# EAGLE design onionboard (EAGLE 6.5.0)
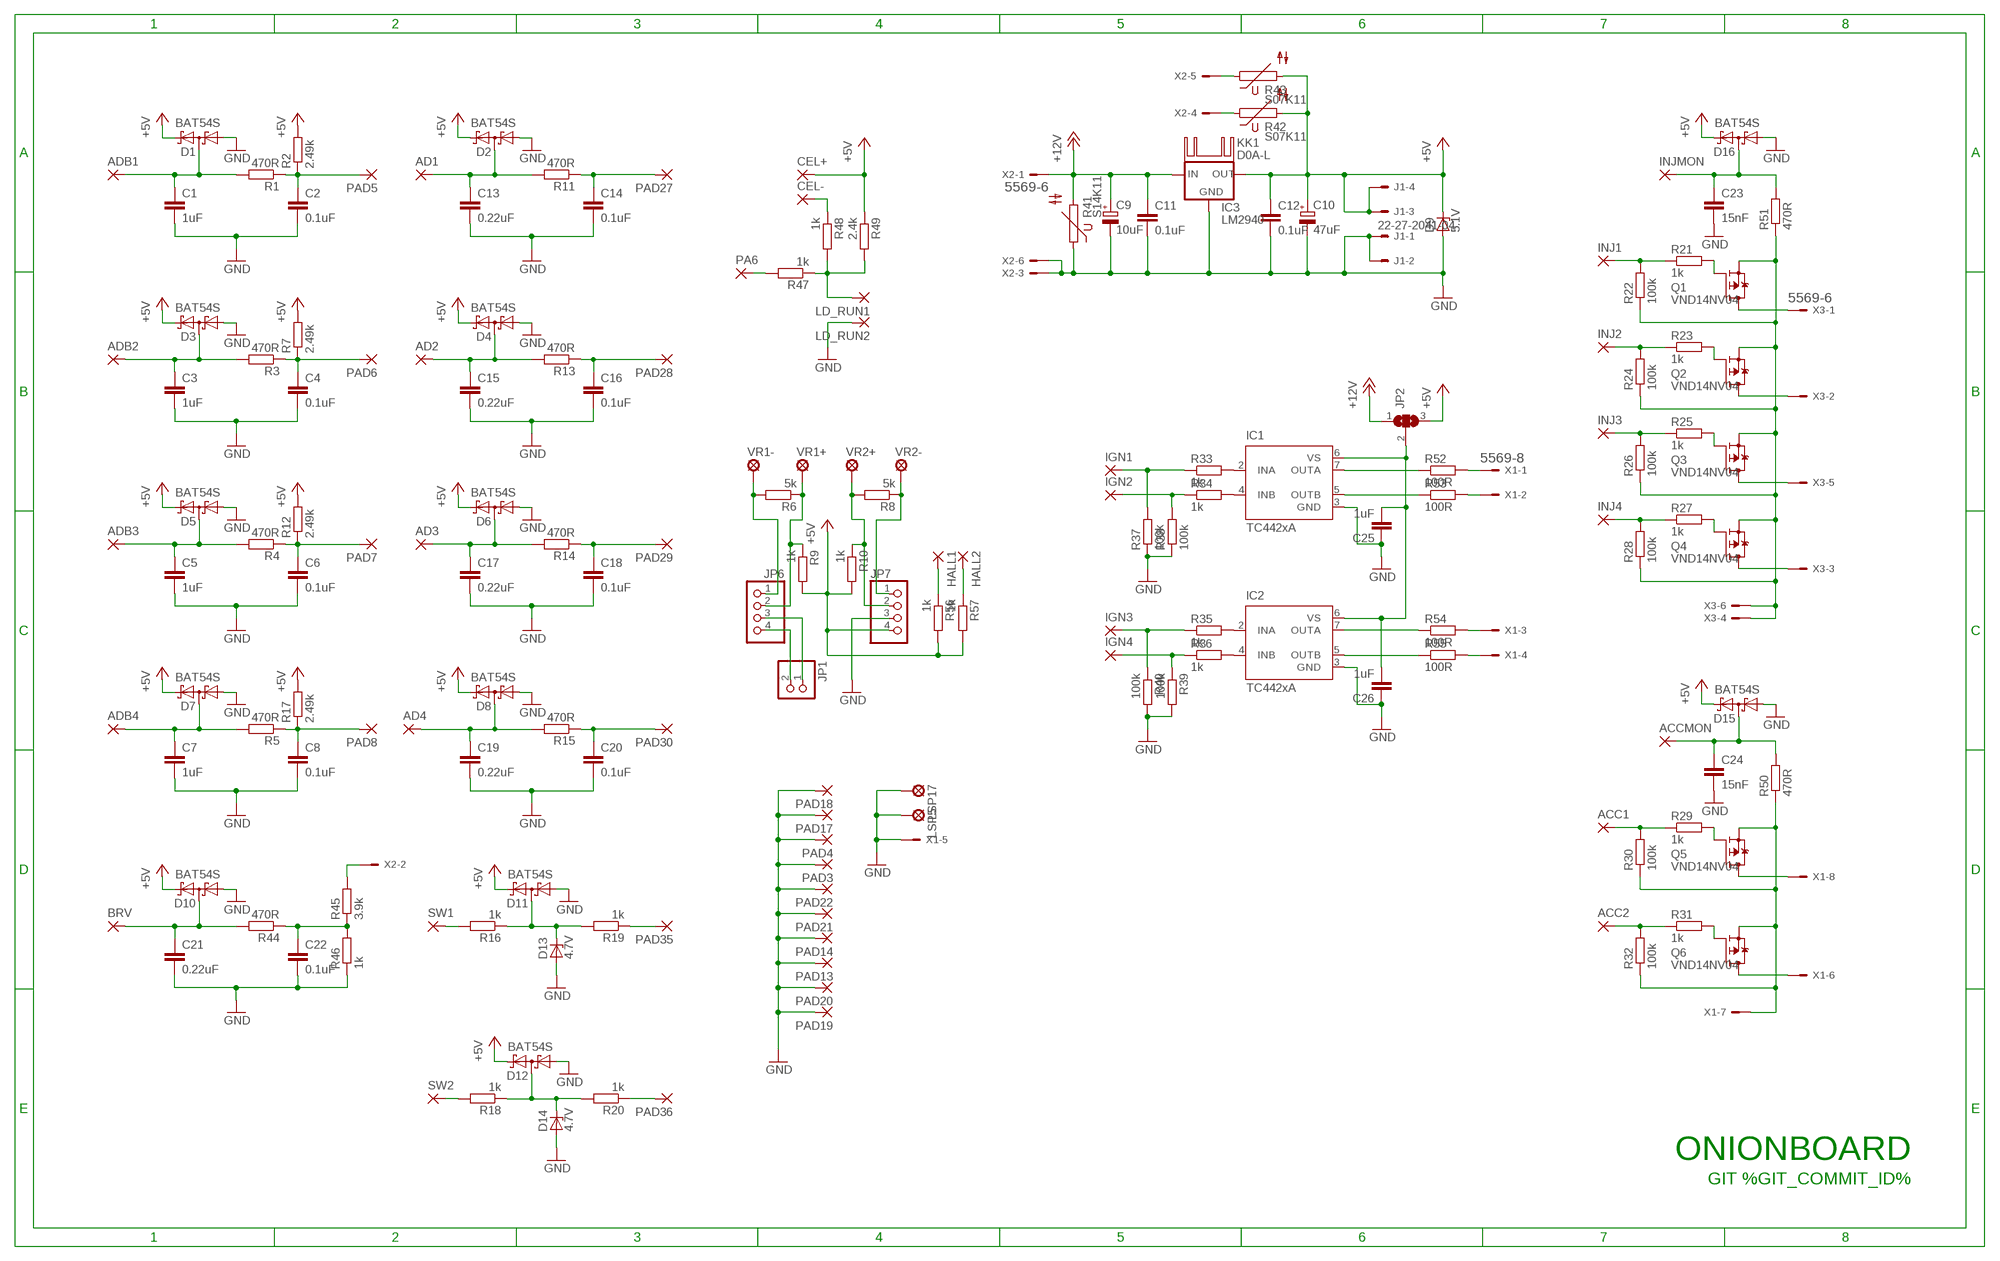
[diagram p0: schematic, sheet 1]

## Parts
ACC1  SMD2  [SMD1,27-2,54]
ACC2  SMD2  [SMD1,27-2,54]
ACCMON  SMD2  [SMD1,27-2,54]
AD1  SMD2  [SMD1,27-2,54]
AD2  SMD2  [SMD1,27-2,54]
AD3  SMD2  [SMD1,27-2,54]
AD4  SMD2  [SMD1,27-2,54]
ADB1  SMD2  [SMD1,27-2,54]
ADB2  SMD2  [SMD1,27-2,54]
ADB3  SMD2  [SMD1,27-2,54]
ADB4  SMD2  [SMD1,27-2,54]
BRV  SMD2  [SMD1,27-2,54]
C1  1uF  C-EUC0805  [C0805]
C2  0.1uF  C-EUC0805  [C0805]
C3  1uF  C-EUC0805  [C0805]
C4  0.1uF  C-EUC0805  [C0805]
C5  1uF  C-EUC0805  [C0805]
C6  0.1uF  C-EUC0805  [C0805]
C7  1uF  C-EUC0805  [C0805]
C8  0.1uF  C-EUC0805  [C0805]
C9  10uF  CPOL-EUSMCE  [SMC_E]
C10  47uF  CPOL-EUSMCE  [SMC_E]
C11  0.1uF  C-EUC1206  [C1206]
C12  0.1uF  C-EUC1206  [C1206]
C13  0.22uF  C-EUC0805  [C0805]
C14  0.1uF  C-EUC0805  [C0805]
C15  0.22uF  C-EUC0805  [C0805]
C16  0.1uF  C-EUC0805  [C0805]
C17  0.22uF  C-EUC0805  [C0805]
C18  0.1uF  C-EUC0805  [C0805]
C19  0.22uF  C-EUC0805  [C0805]
C20  0.1uF  C-EUC0805  [C0805]
C21  0.22uF  C-EUC0805  [C0805]
C22  0.1uF  C-EUC0805  [C0805]
C23  15nF  C-EUC0805  [C0805]
C24  15nF  C-EUC0805  [C0805]
C25  1uF  C-EUC1206  [C1206]
C26  1uF  C-EUC1206  [C1206]
CEL+  SMD2  [SMD1,27-2,54]
CEL-  SMD2  [SMD1,27-2,54]
D1  BAT54S  [SOT23]
D2  BAT54S  [SOT23]
D3  BAT54S  [SOT23]
D4  BAT54S  [SOT23]
D5  BAT54S  [SOT23]
D6  BAT54S  [SOT23]
D7  BAT54S  [SOT23]
D8  BAT54S  [SOT23]
D9  5.1V  ZENER-DIODEP1-12  [P1Z12]
D10  BAT54S  [SOT23]
D11  BAT54S  [SOT23]
D12  BAT54S  [SOT23]
D13  4.7V  ZENER-DIODESOT23  [SOT23]
D14  4.7V  ZENER-DIODESOT23  [SOT23]
D15  BAT54S  [SOT23]
D16  BAT54S  [SOT23]
HALL1  1,6/0,8  [1,6/0,8]
HALL2  1,6/0,8  [1,6/0,8]
IC1  TC442xA  IR4427S  [SO08]
IC2  TC442xA  IR4427S  [SO08]
IC3  LM2940  78XXL  [78XXL]
IGN1  SMD2  [SMD1,27-2,54]
IGN2  SMD2  [SMD1,27-2,54]
IGN3  SMD2  [SMD1,27-2,54]
IGN4  SMD2  [SMD1,27-2,54]
INJ1  SMD2  [SMD1,27-2,54]
INJ2  SMD2  [SMD1,27-2,54]
INJ3  SMD2  [SMD1,27-2,54]
INJ4  SMD2  [SMD1,27-2,54]
INJMON  SMD2  [SMD1,27-2,54]
J1  22-27-2041-04  [6410-04]
JP1  PINHD-1X2  [1X02]
JP2  SJ2W  [SJ_2]
JP6  PINHD-1X4  [1X04]
JP7  PINHD-1X4  [1X04]
KK1  D0A-L  [D02A-L]
LD_RUN1  SMD2  [SMD1,27-2,54]
LD_RUN2  SMD2  [SMD1,27-2,54]
LSP5  LSP10  [LSP10]
LSP17  LSP10  [LSP10]
PA6  SMD2  [SMD1,27-2,54]
PAD3  SMD2  [SMD1,27-2,54]
PAD4  SMD2  [SMD1,27-2,54]
PAD5  SMD2  [SMD1,27-2,54]
PAD6  SMD2  [SMD1,27-2,54]
PAD7  SMD2  [SMD1,27-2,54]
PAD8  SMD2  [SMD1,27-2,54]
PAD13  SMD2  [SMD1,27-2,54]
PAD14  SMD2  [SMD1,27-2,54]
PAD17  SMD2  [SMD1,27-2,54]
PAD18  SMD2  [SMD1,27-2,54]
PAD19  SMD2  [SMD1,27-2,54]
PAD20  SMD2  [SMD1,27-2,54]
PAD21  SMD2  [SMD1,27-2,54]
PAD22  SMD2  [SMD1,27-2,54]
PAD27  SMD2  [SMD1,27-2,54]
PAD28  SMD2  [SMD1,27-2,54]
PAD29  SMD2  [SMD1,27-2,54]
PAD30  SMD2  [SMD1,27-2,54]
PAD35  SMD2  [SMD1,27-2,54]
PAD36  SMD2  [SMD1,27-2,54]
Q1  VND14NV04  FDD4141TO252  [TO252]
Q2  VND14NV04  FDD4141TO252  [TO252]
Q3  VND14NV04  FDD4141TO252  [TO252]
Q4  VND14NV04  FDD4141TO252  [TO252]
Q5  VND14NV04  FDD4141TO252  [TO252]
Q6  VND14NV04  FDD4141TO252  [TO252]
R1  470R  R-EU_R1206  [R1206]
R2  2.49k  R-EU_M0805  [M0805]
R3  470R  R-EU_R1206  [R1206]
R4  470R  R-EU_R1206  [R1206]
R5  470R  R-EU_R1206  [R1206]
R6  5k  R-EU_0411/15  [0411/15]
R7  2.49k  R-EU_M0805  [M0805]
R8  5k  R-EU_0411/15  [0411/15]
R9  1k  R-EU_R0805  [R0805]
R10  1k  R-EU_R0805  [R0805]
R11  470R  R-EU_R1206  [R1206]
R12  2.49k  R-EU_M0805  [M0805]
R13  470R  R-EU_R1206  [R1206]
R14  470R  R-EU_R1206  [R1206]
R15  470R  R-EU_R1206  [R1206]
R16  1k  R-EU_R1206  [R1206]
R17  2.49k  R-EU_M0805  [M0805]
R18  1k  R-EU_R1206  [R1206]
R19  1k  R-EU_R1206  [R1206]
R20  1k  R-EU_R1206  [R1206]
R21  1k  R-EU_M0805  [M0805]
R22  100k  R-EU_M0805  [M0805]
R23  1k  R-EU_M0805  [M0805]
R24  100k  R-EU_M0805  [M0805]
R25  1k  R-EU_M0805  [M0805]
R26  100k  R-EU_M0805  [M0805]
R27  1k  R-EU_M0805  [M0805]
R28  100k  R-EU_M0805  [M0805]
R29  1k  R-EU_M0805  [M0805]
R30  100k  R-EU_M0805  [M0805]
R31  1k  R-EU_M0805  [M0805]
R32  100k  R-EU_M0805  [M0805]
R33  1k  R-EU_M0805  [M0805]
R34  1k  R-EU_M0805  [M0805]
R35  1k  R-EU_M0805  [M0805]
R36  1k  R-EU_M0805  [M0805]
R37  100k  R-EU_M0805  [M0805]
R38  100k  R-EU_M0805  [M0805]
R39  100k  R-EU_M0805  [M0805]
R40  100k  R-EU_M0805  [M0805]
R41  S14K11  [S14K11]
R42  S07K11  [S07K11]
R43  S07K11  [S07K11]
R44  470R  R-EU_R1206  [R1206]
R45  3.9k  R-EU_M0805  [M0805]
R46  1k  R-EU_M0805  [M0805]
R47  1k  R-EU_M0805  [M0805]
R48  1k  R-EU_M0805  [M0805]
R49  2.4k  R-EU_M0805  [M0805]
R50  470R  R-EU_R1206  [R1206]
R51  470R  R-EU_R1206  [R1206]
R52  100R  R-EU_0414/5V  [0414V]
R53  100R  R-EU_0414/5V  [0414V]
R54  100R  R-EU_0414/5V  [0414V]
R55  100R  R-EU_0414/5V  [0414V]
R56  1k  R-EU_R0805  [R0805]
R57  1k  R-EU_R0805  [R0805]
SW1  SMD2  [SMD1,27-2,54]
SW2  SMD2  [SMD1,27-2,54]
VR1+  LSP10  [LSP10]
VR1-  LSP10  [LSP10]
VR2+  LSP10  [LSP10]
VR2-  LSP10  [LSP10]
X1  5569-8  [5569-8]
X2  5569-6  [5569-6]
X3  5569-6  [5569-6]

## Nets
+5V: C10.+ C12.1 CEL+.1(P) D1.2(C2) D2.2(C2) D3.2(C2) D4.2(C2) D5.2(C2) D6.2(C2) D7.2(C2) D8.2(C2) D9.C D10.2(C2) D11.2(C2) D12.2(C2) D15.2(C2) D16.2(C2) IC3.OUT J1.3 J1.4 JP2.3 JP7.4 R2.2 R7.2 R9.2 R10.2 R12.2 R17.2 R42.2 R43.2 R49.1 R56.2 R57.2
+12V: C9.+ C11.1 IC3.IN JP2.1 R41.2 X2.1
GND: C1.2 C2.2 C3.2 C4.2 C5.2 C6.2 C7.2 C8.2 C9.- C10.- C11.2 C12.2 C13.2 C14.2 C15.2 C16.2 C17.2 C18.2 C19.2 C20.2 C21.2 C22.2 C23.2 C24.2 C25.1 C26.1 D1.1(A1) D2.1(A1) D3.1(A1) D4.1(A1) D5.1(A1) D6.1(A1) D7.1(A1) D8.1(A1) D9.A D10.1(A1) D11.1(A1) D12.1(A1) D13.1(A) D14.1(A) D15.1(A1) D16.1(A1) IC1.3(GND) IC2.3(GND) IC3.GND J1.1 J1.2 JP7.3 LD_RUN2.1(P) LSP5.MP LSP17.MP PAD3.1(P) PAD4.1(P) PAD13.1(P) PAD14.1(P) PAD17.1(P) PAD18.1(P) PAD19.1(P) PAD20.1(P) PAD21.1(P) PAD22.1(P) R37.1 R38.1 R39.2 R40.2 R41.1 R46.1 X1.5 X2.3 X2.6
GNDAUX: Q5.2(S) Q6.2(S) R30.1 R32.1 R50.1 X1.7
GNDINJ: Q1.2(S) Q2.2(S) Q3.2(S) Q4.2(S) R22.1 R24.1 R26.1 R28.1 R51.1 X3.4 X3.6
IGNVCC: C25.2 C26.2 IC1.6(VS) IC2.6(VS) JP2.2
N$1: C2.1 PAD5.1(P) R1.1 R2.1
N$2: C14.1 PAD27.1(P) R11.1
N$3: AD1.1(P) C13.1 D2.3(C1A2) R11.2
N$4: AD2.1(P) C15.1 D4.3(C1A2) R13.2
N$5: C16.1 PAD28.1(P) R13.1
N$6: ADB1.1(P) C1.1 D1.3(C1A2) R1.2
N$7: Q6.3(D) X1.6
N$8: ADB2.1(P) C3.1 D3.3(C1A2) R3.2
N$9: C4.1 PAD6.1(P) R3.1 R7.1
N$10: C18.1 PAD29.1(P) R14.1
N$11: AD3.1(P) C17.1 D6.3(C1A2) R14.2
N$12: IGN1.1(P) R33.1 R37.2
N$13: AD4.1(P) C19.1 D8.3(C1A2) R15.2
N$14: IGN2.1(P) R34.1 R38.2
N$15: C20.1 PAD30.1(P) R15.1
N$18: ADB3.1(P) C5.1 D5.3(C1A2) R4.2
N$19: ADB4.1(P) C7.1 D7.3(C1A2) R5.2
N$23: C6.1 PAD7.1(P) R4.1 R12.1
N$24: PA6.1(P) R47.2
N$25: IGN3.1(P) R35.1 R40.1
N$26: IGN4.1(P) R36.1 R39.1
N$27: IC1.7(OUTA) R52.1
N$28: IC2.5(OUTB) R55.1
N$29: C8.1 PAD8.1(P) R5.1 R17.1
N$30: JP6.1 R6.2 VR1-.MP
N$31: IC1.5(OUTB) R53.1
N$32: IC2.7(OUTA) R54.1
N$33: JP6.2 R6.1 R9.1 VR1+.MP
N$34: JP7.2 R8.2 R10.1 VR2+.MP
N$35: JP7.1 R8.1 VR2-.MP
N$36: ACCMON.1(P) C24.1 D15.3(C1A2) R50.2
N$37: C23.1 D16.3(C1A2) INJMON.1(P) R51.2
N$38: ACC1.1(P) R29.1 R30.2
N$39: Q5.3(D) X1.8
N$40: INJ1.1(P) R21.1 R22.2
N$41: INJ2.1(P) R23.1 R24.2
N$42: INJ3.1(P) R25.1 R26.2
N$43: INJ4.1(P) R27.1 R28.2
N$44: IC1.2(INA) R33.2
N$45: IC1.4(INB) R34.2
N$46: IC2.4(INB) R36.2
N$47: IC2.2(INA) R35.2
N$48: R45.2 X2.2
N$49: JP1.1 JP6.3
N$50: R52.2 X1.1
N$51: R43.1 X2.5
N$52: R42.1 X2.4
N$53: ACC2.1(P) R31.1 R32.2
N$54: R53.2 X1.2
N$55: R54.2 X1.3
N$56: JP1.2 JP6.4
N$57: D11.3(C1A2) D13.3(C) R16.1 R19.2
N$58: PAD36.1(P) R20.1
N$60: D12.3(C1A2) D14.3(C) R18.1 R20.2
N$61: Q2.1(G) R23.2
N$62: Q3.1(G) R25.2
N$63: Q4.1(G) R27.2
N$64: Q5.1(G) R29.2
N$65: Q6.1(G) R31.2
N$66: Q1.1(G) R21.2
N$67: BRV.1(P) C21.1 D10.3(C1A2) R44.2
N$68: C22.1 R44.1 R45.1 R46.2
N$69: R55.2 X1.4
N$70: HALL2.1(P) R57.1
N$71: R16.2 SW1.1(P)
N$72: PAD35.1(P) R19.1
N$73: R18.2 SW2.1(P)
N$74: HALL1.1(P) R56.1
N$80: Q4.3(D) X3.3
N$81: LD_RUN1.1(P) R47.1 R48.2 R49.2
N$82: Q3.3(D) X3.5
N$83: Q2.3(D) X3.2
N$84: Q1.3(D) X3.1
N$86: CEL-.1(P) R48.1

## Notes on the sheet
- ONIONBOARD
- GIT %GIT_COMMIT_ID%

## Library data of the parts
ACC1 ACC2 ACCMON AD1-AD4 ADB1-ADB4 BRV CEL+ CEL- IGN1-IGN4 INJ1-INJ4 INJMON LD_RUN1 LD_RUN2 PA6 PAD3-PAD8 PAD13 PAD14 PAD17-PAD22 PAD27-PAD30 PAD35 PAD36 SW1 SW2 = wirepad:SMD2: SMD PAD
C1-C8 C11-C26 = resistor:C-EU: CAPACITOR, European symbol
C9 C10 = resistor:CPOL-EU: POLARIZED CAPACITOR, European symbol
D1-D8 D10-D12 D15 D16 = diode:BAT54S: Schottky Diodes Pin connection corrected 2011-05-04 Source: Fairchild .. BAT54.pdf
D9 D13 D14 = diode:ZENER-DIODE: Z-Diode
HALL1 HALL2 = wirepad:1,6/0,8: THROUGH-HOLE PAD
IC1 IC2 = ir:IR4427: DUAL LOW SIDE DRIVER Source: ID4426.pdf; MF: INTERNATIONAL RECTIFIER(IR); MPN: IR4427STRPBF; OC_FARNELL: 8639094; OC_NEWARK: 63J7933
IC3 = v-reg:78XXL: VOLTAGE REGULATOR
J1 = con-molex:22-?-04: CONNECTOR wire to board 2.54 mm (.1 inch) pitch header; OC_FARNELL: unknown; OC_NEWARK: unknown
JP1 = pinhead:PINHD-1X2: PIN HEADER
JP2 = jumper:SJ2W: SMD solder JUMPER
JP6 JP7 = pinhead:PINHD-1X4: PIN HEADER
KK1 = heatsink:D0A-L: HEATSINK distributor Schukat
LSP5 LSP17 VR1+ VR1- VR2+ VR2- = solpad:LSP10: SOLDER PAD drill 1.0 mm, distributor Buerklin, 12H555
Q1-Q6 = transistor-fet:FDD4141: P-Channel PowerTrench® MOSFET Source: FDD4141.pdf
R1-R40 R44-R57 = resistor:R-EU_: RESISTOR, European symbol
R41 = varistor:S14K11: VARISTOR
R42 R43 = varistor:S07K11: VARISTOR
X1 = con-molex-5569:5569-8: 4.20mm Pitch Mini-Fit Jr.™ - 8 pin Source: http://www.molex.com/pdm_docs/sd/039307025_sd.pdf
X2 X3 = con-molex-5569:5569-6: 4.20mm Pitch Mini-Fit Jr.™ - 6 pin Source: http://www.molex.com/pdm_docs/sd/039307025_sd.pdf

## Board
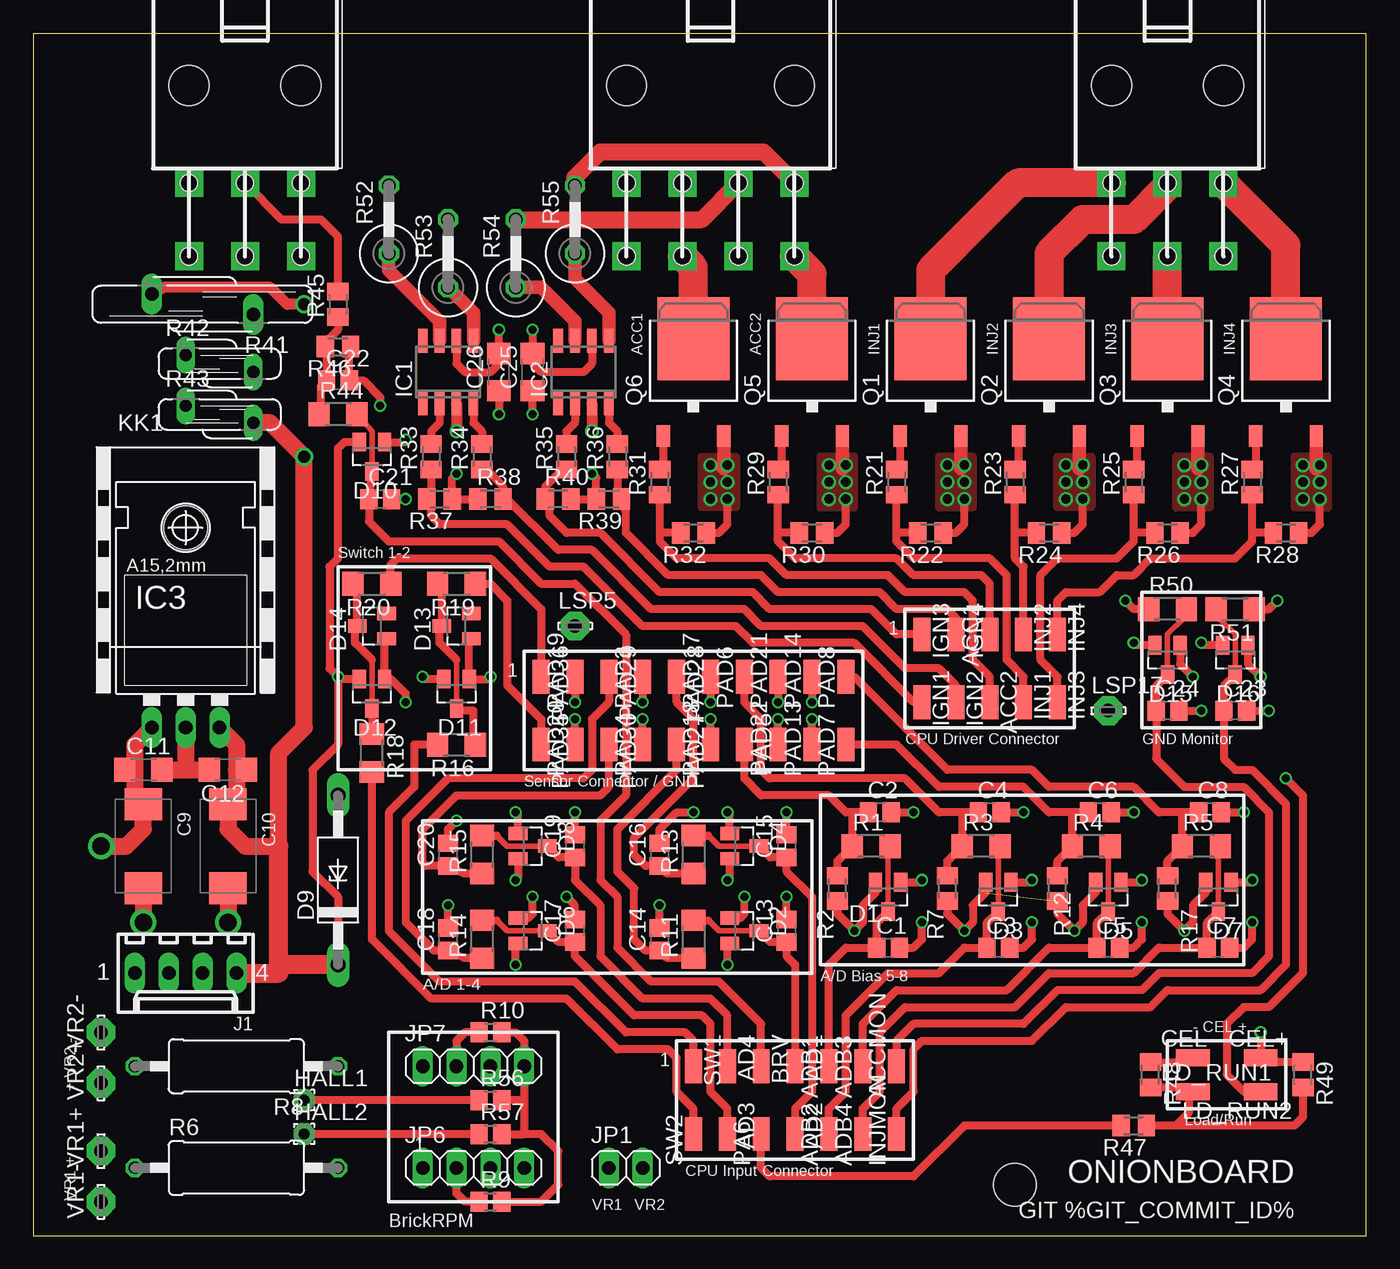
[diagram p1: board, top side]
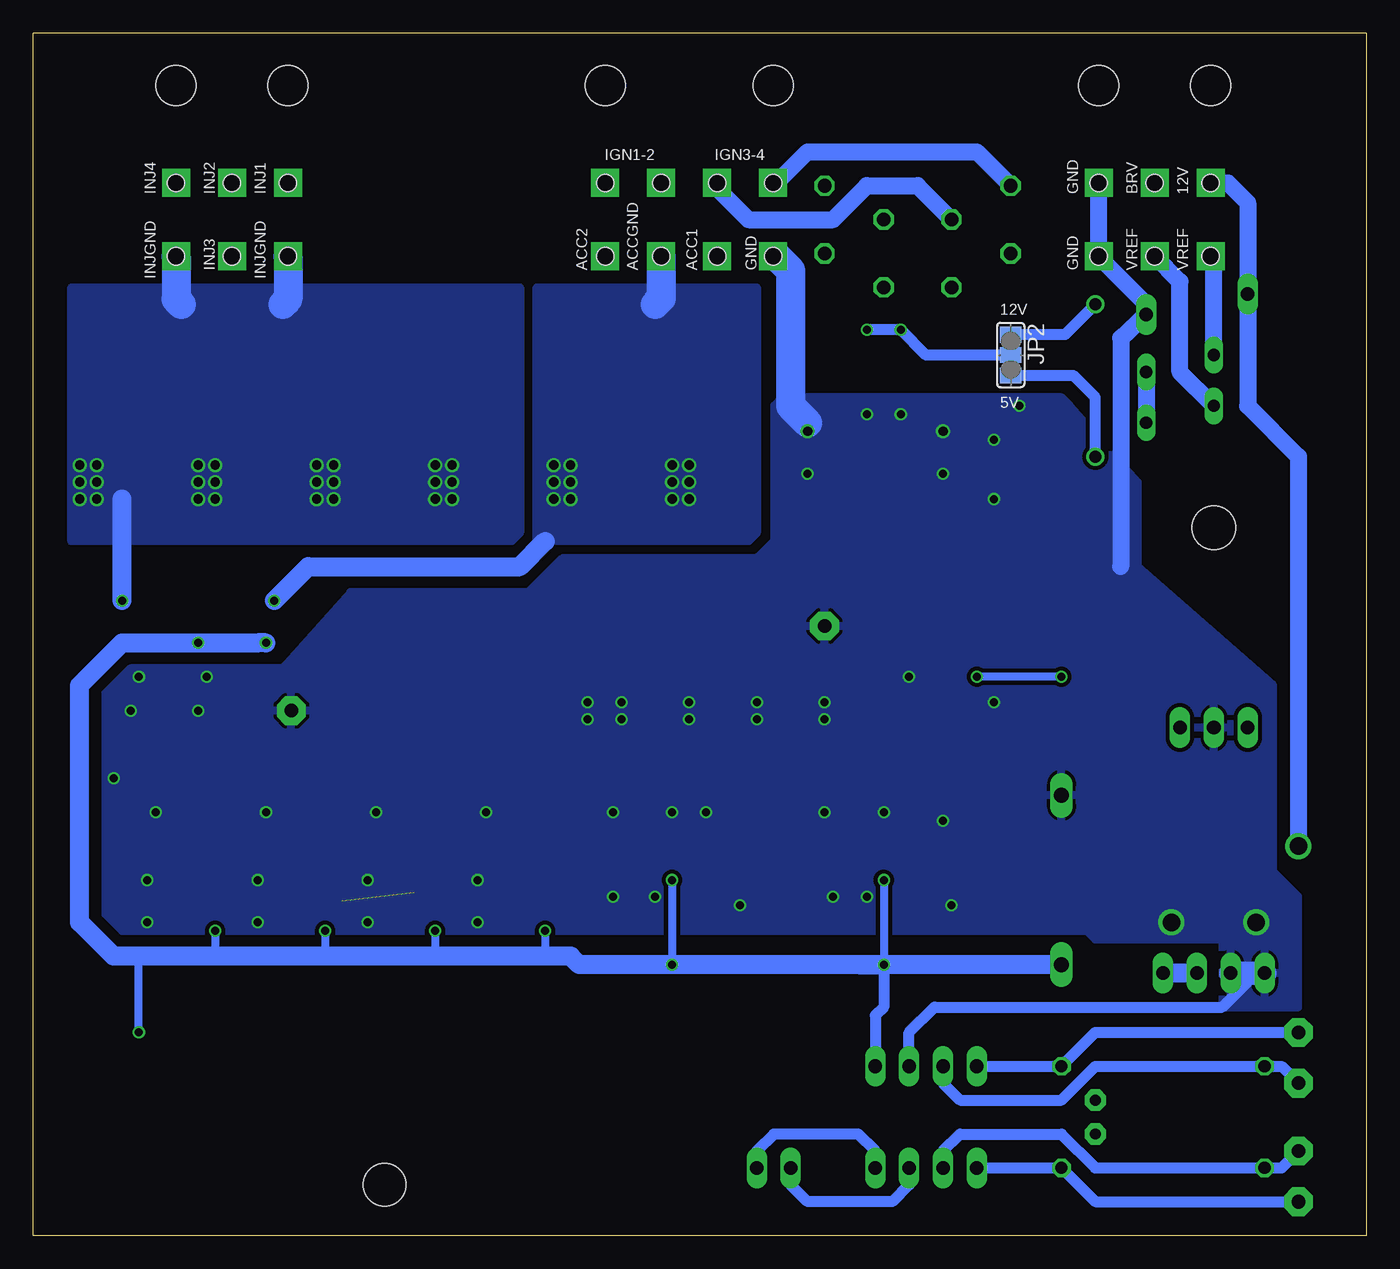
[diagram p2: board, bottom side, seen from below]

Size 100 x 90.17 mm. Coordinates in mm from the lower left corner, seen from the top.
Outline: 0,0 100,0 100,90.17 0,90.17 0,0
Copper layers (1*2*15*16): Top 0.035mm / dielectric 0.2mm / layer 2 0.0175mm / dielectric 1.1mm / layer 15 0.0175mm / dielectric 0.2mm / Bottom 0.035mm
Design rules "SeeedStudio_DRU_no_angle_20130527": minimum track width 6mil, minimum drill 12mil, track to track 6mil, track to pad 6mil, pad to pad 6mil, via to via 6mil, smd to smd 0mil, copper to edge 10mil, drill to drill 10mil, minimum pad ring 6mil, minimum via ring 6mil, stop-mask expansion 2mil, vias tented up to drill 25mil, thermal gap 10mil
Holes 3.2 mm at 73.66,3.81

### Footprints (pad centres in the part's own frame; a part is rotated, then mirrored left to right if it is on the bottom)
SMD1,27-2,54 = smd 1.27 x 2.54: 1 0,0
C0805 = smd 1.3 x 1.5: 1 -0.85,0; 2 0.85,0
SMC_E = smd 2.4 x 2.8: + -3.15,0; - 3.15,0
C1206 = smd 1.6 x 1.8: 1 -1.4,0; 2 1.4,0
SOT23 = smd 1 x 1.4: 1 -0.95,-1.1; 2 0.95,-1.1; 3 0,1.1
P1Z12 = drill 1.118 long: A 6.35,0; C -6.35,0
1,6/0,8 = drill 0.813 pad 1.6 octagon: 1 0,0
SO08 = smd 0.72 x 1.78: 1 -1.905,-2.35; 2 -0.635,-2.35; 3 0.635,-2.35; 4 1.905,-2.35; 5 1.905,2.35; 6 0.635,2.35; 7 -0.635,2.35; 8 -1.905,2.35
78XXL = drill 1.016 long: GND 0,-3.81; IN -2.54,-3.81; OUT 2.54,-3.81 | hole 3.302: 0,11.176
6410-04 = drill 1.016 long: 1 3.81,0; 2 1.27,0; 3 -1.27,0; 4 -3.81,0
1X02 = drill 1.016 long: 1 -1.27,0; 2 1.27,0
SJ_2 = smd 1.168 x 1.6: 1 -1.524,0; 2 0,0; 3 1.524,0
1X04 = drill 1.016 long: 1 -3.81,0; 2 -1.27,0; 3 1.27,0; 4 3.81,0
LSP10 = drill 1.016 pad 2.159 octagon: MP 0,0
TO252 = smd 1 x 1.6: 1 -2.28,-4.8; 2 2.28,-4.8 | smd 5.4 x 6.2: 3 0,2.5
R1206 = smd 1.6 x 1.803: 1 -1.422,0; 2 1.422,0
M0805 = smd 1.3 x 1.6: 1 -0.95,0; 2 0.95,0
0411/15 = drill 0.914 octagon: 1 -7.62,0; 2 7.62,0
R0805 = smd 1.3 x 1.5: 1 -0.85,0; 2 0.85,0
S14K11 = drill 1.016 long: 1 -0.762,-3.81; 2 0.762,3.81
S07K11 = drill 0.914 long: 1 -0.635,-2.54; 2 0.635,2.54
0414V = drill 1.016 octagon: 1 -2.54,0; 2 2.54,0
5569-8 = drill 1.4 square: 1 6.3,-2.75; 2 2.1,-2.75; 3 -2.1,-2.75; 4 -6.3,-2.75; 5 6.3,2.75; 6 2.1,2.75; 7 -2.1,2.75; 8 -6.3,2.75 | hole 3: -6.3,-10.05; 6.3,-10.05 | hole 1.3: 6.3,-2.75; 6.3,2.75; 2.1,-2.75; 2.1,2.75; -2.1,-2.75; -2.1,2.75; -6.3,-2.75; -6.3,2.75
5569-6 = drill 1.4 square: 1 4.2,-2.75; 2 0,-2.75; 3 -4.2,-2.75; 4 4.2,2.75; 5 0,2.75; 6 -4.2,2.75 | hole 3: -4.2,-10.05; 4.2,-10.05 | hole 1.3: -4.2,-2.75; 0,-2.75; 4.2,-2.75; -4.2,2.75; 0,2.75; 4.2,2.75

### Placement (x,y rotation side)
ACC1  71.75,45.09 0 top
ACC2  71.75,40.01 180 top
ACCMON  64.77,12.7 0 top
AD1  57.15,12.7 180 top
AD2  57.15,7.62 180 top
AD3  52.07,7.62 180 top
AD4  52.07,12.7 180 top
ADB1  59.69,12.7 0 top
ADB2  59.69,7.62 0 top
ADB3  62.23,12.7 0 top
ADB4  62.23,7.62 0 top
BRV  54.61,12.7 180 top
C1  64.14,21.59 0 top
C2  63.5,31.75 0 top
C3  72.39,21.59 0 top
C4  71.75,31.75 0 top
C5  80.64,21.59 0 top
C6  80.01,31.75 0 top
C7  88.9,21.59 0 top
C8  88.27,31.75 0 top
C9  8.26,29.21 270 top
C10  14.61,29.21 270 top
C11  8.26,34.92 0 top
C12  14.61,34.92 180 top
C13  56.52,22.86 90 top
C14  46.99,22.23 90 top
C15  56.52,29.21 90 top
C16  46.99,28.57 90 top
C17  40.64,22.86 90 top
C18  31.11,22.23 90 top
C19  40.64,29.21 90 top
C20  31.11,28.57 90 top
C21  26.04,55.24 0 top
C22  22.86,64.14 0 top
C23  90.17,39.37 0 top
C24  85.09,39.37 0 top
C25  37.47,64.77 90 top
C26  34.92,64.77 90 top
CEL+  92.08,13.34 270 top
CEL-  87,13.34 270 top
D1  64.14,25.4 180 top
D2  53.34,22.86 270 top
D3  72.39,25.4 180 top
D4  53.34,29.21 270 top
D5  80.64,25.4 180 top
D6  37.47,22.86 270 top
D7  88.9,25.4 180 top
D8  37.47,29.21 270 top
D9  22.86,26.67 90 top
D10  25.4,58.42 180 top
D11  31.75,40.64 180 top
D12  25.4,40.64 180 top
D13  31.75,45.72 90 top
D14  25.4,45.72 90 top
D15  85.09,43.18 180 top
D16  90.17,43.18 180 top
HALL1  20.32,10.16 0 top
HALL2  20.32,7.62 0 top
IC1  31.11,64.77 0 top
IC2  41.27,64.77 0 top
IC3  11.43,41.91 0 top
IGN1  66.67,40.01 180 top
IGN2  69.22,40.01 180 top
IGN3  66.67,45.09 180 top
IGN4  69.22,45.09 180 top
INJ1  74.3,40.01 180 top
INJ2  74.3,45.09 180 top
INJ3  76.83,40.01 180 top
INJ4  76.83,45.09 180 top
INJMON  64.77,7.62 0 top
J1  11.43,19.68 180 top
JP1  44.45,5.08 0 top
JP2  26.67,66.04 270 bottom
JP6  33.02,5.08 0 top
JP7  33.02,12.7 0 top
KK1  11.43,47.62 270 top
LD_RUN1  87,10.79 270 top
LD_RUN2  92.08,10.79 90 top
LSP5  40.64,45.72 0 top
LSP17  80.64,39.37 0 top
PA6  54.61,7.62 0 top
PAD3  45.72,41.91 0 top
PAD4  45.72,36.83 0 top
PAD5  53.34,36.83 180 top
PAD6  53.34,41.91 0 top
PAD7  60.96,36.83 0 top
PAD8  60.96,41.91 0 top
PAD13  58.42,36.83 0 top
PAD14  58.42,41.91 0 top
PAD17  50.8,41.91 0 top
PAD18  50.8,36.83 0 top
PAD19  40.64,41.91 0 top
PAD20  40.64,36.83 0 top
PAD21  55.88,41.91 0 top
PAD22  55.88,36.83 0 top
PAD27  48.26,36.83 180 top
PAD28  48.26,41.91 180 top
PAD29  43.18,41.91 180 top
PAD30  43.18,36.83 180 top
PAD35  38.1,36.83 180 top
PAD36  38.1,41.91 180 top
Q1  67.31,64.77 0 top
Q2  76.2,64.77 0 top
Q3  85.09,64.77 0 top
Q4  93.98,64.77 0 top
Q5  58.42,64.77 0 top
Q6  49.53,64.77 0 top
R1  62.87,29.21 0 top
R2  60.33,26.04 270 top
R3  71.12,29.21 0 top
R4  79.38,29.21 0 top
R5  87.63,29.21 0 top
R6  15.24,5.08 0 top
R7  68.58,26.04 270 top
R8  15.24,12.7 180 top
R9  34.29,2.54 0 top
R10  34.29,15.24 0 top
R11  49.53,22.23 90 top
R12  76.83,26.04 270 top
R13  49.53,28.57 90 top
R14  33.66,22.23 90 top
R15  33.66,28.57 90 top
R16  31.75,36.83 180 top
R17  85.09,26.04 270 top
R18  25.4,36.2 270 top
R19  31.75,48.9 180 top
R20  25.4,48.9 180 top
R21  64.77,56.52 90 top
R22  67.31,52.7 180 top
R23  73.66,56.52 90 top
R24  76.2,52.7 180 top
R25  82.55,56.52 90 top
R26  85.09,52.7 180 top
R27  91.44,56.52 90 top
R28  93.98,52.7 180 top
R29  55.88,56.52 90 top
R30  58.42,52.7 180 top
R31  46.99,56.52 90 top
R32  49.53,52.7 180 top
R33  29.84,58.42 90 top
R34  33.66,58.42 90 top
R35  40.01,58.42 90 top
R36  43.81,58.42 90 top
R37  30.48,55.24 180 top
R38  34.29,55.24 0 top
R39  43.18,55.24 180 top
R40  39.37,55.24 0 top
R41  12.7,69.85 90 top
R42  13.97,65.41 270 top
R43  13.97,61.59 270 top
R44  22.86,61.59 0 top
R45  22.86,69.85 90 top
R46  22.86,66.67 180 top
R47  82.55,8.26 180 top
R48  83.82,12.06 270 top
R49  95.25,12.06 270 top
R50  85.09,46.99 0 top
R51  90.17,46.99 180 top
R52  26.67,76.2 90 top
R53  31.11,73.66 90 top
R54  36.2,73.66 90 top
R55  40.64,76.2 90 top
R56  34.29,10.16 0 top
R57  34.29,7.62 0 top
SW1  49.53,12.7 180 top
SW2  49.53,7.62 0 top
VR1+  5.08,6.35 90 top
VR1-  5.08,2.54 90 top
VR2+  5.08,11.43 90 top
VR2-  5.08,15.24 90 top
X1  50.8,76.2 180 top
X2  15.88,76.2 180 top
X3  85.09,76.2 180 top

### Tracks (layer width: path | path; a pad name or v marks a point on that pad's centre or on a via)
+5V  (via drill 0.6, 0.9)  (1 unrouted)
  Top 0.61: v36.2,20.32 36.2,21.59 | 36.2,21.59 36.2,21.74 | 29.38,41.74 v29.21,41.91 29.21,41.74 D11.2 | 82.72,44.28 v82.55,44.45 82.55,44.28 D15.2 | 87.8,44.28 v87.63,44.45 87.63,44.28 D16.2 | v52.07,20.32 52.07,21.59 | 52.07,21.59 52.07,21.74 | 23.03,41.74 v22.86,41.91 | v22.86,41.91 22.23,42.55 22.23,50.16 22.86,50.8 22.86,59.05 23.32,59.52 D10.2 | v22.86,41.91 22.86,36.83 20.95,34.92 20.95,27.3 22.86,25.4 D9.C | R49.1 92.39,13.02 CEL+.1 v92.08,15.24 | R12.2 76.83,24.13 v78.11,22.86 78.74,23.5 78.74,24.77 79.69,25.72 D5.2 | R10.2 36.2,15.24 36.83,14.61 JP7.4 36.83,10.16 | R9.2 38.1,2.54 39.37,3.81 39.37,6.35 38.1,7.62 36.83,7.62 | D7.2 87.95,25.72 87,24.77 87,23.5 v86.36,22.86 85.09,24.13 R17.2 | D12.2 22.86,41.74 v22.86,41.91 | D8.2 36.37,26.84 v36.2,26.67 | D4.2 52.24,26.84 v52.07,26.67 | D1.2 63.19,25.72 62.23,24.77 62.23,23.5 v61.59,22.86 60.33,24.13 R2.2 | R7.2 68.58,24.13 v69.85,22.86 70.48,23.5 70.48,24.77 71.44,25.72 D3.2 | 36.83,10.16 36.83,7.62 | 36.83,10.16 R56.2 | R57.2 36.83,7.62 | D6.2 36.37,21.76 36.2,21.59 | D2.2 52.24,21.76 52.07,21.59
  Top 1.27: IC3.OUT 15.24,36.83 15.24,34.92 | R43.2 17.78,60.96 v20.32,58.42 20.32,38.1 18.41,36.2 18.41,29.21 15.88,29.21 14.61,30.48 C10.+ 15.24,32.99 15.24,34.92 | 15.74,35.05 15.24,34.92 | C12.1 15.24,34.92
  Top 1.422: J1.4 18.41,19.68 18.41,20.32 | 18.41,20.32 18.41,29.21 | D9.C 18.41,20.32
  Bottom 0.61: v87.63,44.45 83.19,44.45 | v69.85,22.86 69.85,20.95 | v61.59,22.86 61.59,20.95 | v36.2,26.67 v36.2,20.32 | v52.07,26.67 v52.07,20.32 | v92.08,15.24 92.08,20.95 | v22.86,41.91 v29.21,41.91 | v86.36,22.86 86.36,20.95 | v78.11,22.86 78.11,20.95
  Bottom 0.813: v20.32,58.42 20.32,62.87 21.97,64.52 JP2.3 | v36.2,20.32 36.2,17.14 36.83,16.51 JP7.4
  Bottom 1.27: R42.2 R43.2
  Bottom 1.422: D9.C v36.2,20.32 | 38.1,20.32 v36.2,20.32 | v36.2,20.32 v52.07,20.32 59.05,20.32 59.69,20.95 61.59,20.95 69.85,20.95 92.08,20.95 93.98,20.95 96.52,23.5 96.52,41.27 93.34,44.45 83.19,44.45 v82.55,44.45 | J1.3 J1.4 | 78.11,20.95 86.36,20.95
+12V  (via drill 0.9, 1.3)
  Top 0.813: v20.32,69.85 19.05,69.85 17.78,71.12 9.78,71.12 R41.2
  Top 1.27: IC3.IN 7.62,36.83 7.62,35.05 | 7.62,35.05 C11.1 | v5.08,29.21 6.99,29.21 8.26,30.48 C9.+ 7.62,32.99 7.62,35.05
  Bottom 0.813: v20.32,69.85 22.61,67.56 JP2.1
  Bottom 1.27: v5.08,29.21 5.08,58.42 8.89,62.23 R41.2 8.89,77.47 10.37,78.95 X2.1
GND  (via drill 0.6, 0.6 pad 0.81, 0.7, 1.3)
  Top 0.61: C23.2 v92.71,39.37 | C2.2 v66.04,31.75 | C13.2 v56.52,25.4 | D2.1 53.02,23.81 53.34,24.13 v53.34,25.4 | C14.2 v46.99,24.77 | D1.1 66.5,26.5 v66.67,26.67 | C1.2 66.04,21.59 66.67,22.23 v66.67,23.5 | R38.1 R37.1 31.43,56.83 v31.75,57.15 | R40.2 R39.2 42.23,56.83 v41.91,57.15 | C26.1 v34.92,61.59 | v37.47,61.59 C25.1 | LD_RUN2.1 90.81,10.79 89.53,12.06 89.53,15.88 90.81,17.14 92.71,17.14 95.25,19.68 95.25,33.02 v93.98,34.29 | C20.2 31.11,30.48 v31.75,31.11 | D8.1 36.37,31.58 v36.2,31.75 | C19.2 v40.64,31.75 | D4.1 52.24,31.58 v52.07,31.75 | C15.2 v56.52,31.75 | C18.2 v31.11,24.77 | D6.1 37.15,23.81 37.47,24.13 v37.47,25.4 | C17.2 40.64,24.77 v40.01,25.4 | C3.2 74.3,21.59 74.93,22.23 v74.93,23.5 | D3.1 74.76,26.5 v74.93,26.67 | C4.2 v74.3,31.75 | C6.2 v82.55,31.75 | D5.1 83.02,26.5 v83.19,26.67 | C5.2 82.55,21.59 83.19,22.23 v83.19,23.5 | C8.2 v90.81,31.75 | D7.1 91.27,26.5 v91.44,26.67 | C7.2 90.81,21.59 91.44,22.23 v91.44,23.5 | C16.2 46.99,30.48 48.26,31.75 v49.53,31.75 | D13.1 32.7,44.62 D11.1 34.12,41.74 v34.29,41.91 | D14.1 26.35,44.62 D12.1 26.84,41.74 27.94,40.64 v27.94,40.01 | R46.1 23.71,66.58 C22.2 24.77,64.14 26.04,62.87 v26.04,62.23 | PAD19.1 v40.64,40.01 | PAD3.1 v45.72,40.01 | PAD17.1 v50.8,40.01 | PAD21.1 v55.88,40.01 | PAD14.1 v58.42,40.01 | PAD13.1 v58.42,38.73 | PAD20.1 v40.64,38.73 | PAD4.1 v45.72,38.73 | PAD18.1 v50.8,38.73 | PAD22.1 v55.88,38.73 | D10.1 27.77,59.52 v27.94,59.69 | C21.2 v27.94,55.24 | C24.2 v87.63,39.37 | D15.1 86.04,42.87 v87,41.91 | D16.1 91.12,42.87 v92.08,41.91
  Top 0.813: IC1.3 v31.75,60.33 | IC2.3 v41.91,60.33
  Top 1.27: C11.2 11.43,34.92 | 11.43,34.92 C12.2 | IC3.GND 11.43,34.92 | C10.- v14.61,23.5 | C9.- v8.26,23.5
  Bottom 0.813: JP7.3 34.29,15.24 32.38,17.14 10.79,17.14 8.89,19.05
  Bottom 1.27: 18.41,50.16 18.41,67.31 R41.1 16.51,69.85 20.07,73.42 X2.6 X2.3
  Bottom 1.778: J1.1 J1.2
  Bottom 2.184: X1.5 44.24,73.45 43.18,72.39 43.18,62.23 41.91,60.96
  pour Bottom (isolate 0.305): 44.45,62.23 44.45,52.07 45.72,50.8 60.33,50.8 62.87,48.26 76.2,48.26 81.28,42.55 92.71,42.55 94.61,40.64 94.61,24.13 93.34,22.86 20.95,22.86 20.32,22.23 10.79,22.23 10.79,17.14 5.08,17.14 5.08,25.4 6.99,27.3 6.99,41.27 17.14,50.16 17.14,56.52 22.23,62.23 22.86,62.87 43.81,62.87
GNDAUX  (via drill 0.6, 0.7)
  Top 0.61: R50.1 82.55,46.99 v81.92,47.62 | 51.81,57.52 v50.8,57.78 | R32.1 51.44,52.7 52.07,53.34 v52.07,55.24 | R30.1 60.33,52.7 60.96,53.34 v60.96,55.24
  Top 1.016: Q6.2 51.81,57.52 | Q5.2 60.7,57.52
  Bottom 1.422: v81.92,47.62 79.38,50.16 63.5,50.16 61.59,52.07
  Bottom 2.184: X1.7 52.9,70.29 53.34,69.85
  other vias: 50.8,56.52 52.07,57.78 52.07,56.52 50.8,55.24 59.69,56.52 59.69,57.78 60.96,57.78 60.96,56.52 59.69,55.24
  pour Top (no thermals): 50.16,58.42 52.7,58.42 52.7,54.61 50.16,54.61
  pour Top (no thermals): 59.05,58.42 59.05,54.61 61.59,54.61 61.59,58.42
  pour Bottom (no thermals): 45.72,71.12 45.72,52.7 46.35,52.07 62.23,52.07 62.23,71.12
GNDINJ  (via drill 0.6, 0.7)
  Top 0.61: R51.1 92.71,46.99 v93.34,47.62 | R22.1 69.22,52.7 69.85,53.34 v69.85,55.24 | R24.1 78.11,52.7 78.74,53.34 v78.74,55.24 | R26.1 87,52.7 87.63,53.34 v87.63,55.24 | R28.1 95.89,52.7 96.52,53.34 v96.52,55.24
  Top 1.016: Q3.2 87.37,57.52 | Q4.2 96.26,57.52 | Q1.2 69.59,57.52 | Q2.2 78.48,57.52
  Bottom 1.422: v93.34,47.62 93.34,55.24
  Bottom 2.184: X3.4 80.89,70.24 81.28,69.85 | X3.6 89.29,70.24 88.9,69.85
  other vias: 68.58,57.78 69.85,57.78 68.58,56.52 69.85,56.52 68.58,55.24 77.47,57.78 77.47,56.52 77.47,55.24 78.74,57.78 78.74,56.52 86.36,57.78 86.36,56.52 86.36,55.24 87.63,57.78 87.63,56.52 95.25,57.78 96.52,57.78 95.25,56.52 96.52,56.52 95.25,55.24
  pour Top (no thermals): 70.48,58.42 67.94,58.42 67.94,54.61 70.48,54.61
  pour Top (no thermals): 76.83,58.42 79.38,58.42 79.38,54.61 76.83,54.61
  pour Top (no thermals): 85.72,58.42 85.72,54.61 88.27,54.61 88.27,58.42
  pour Top (no thermals): 94.61,58.42 94.61,54.61 97.16,54.61 97.16,58.42
  pour Bottom (no thermals): 63.5,71.12 63.5,52.7 64.14,52.07 97.16,52.07 97.16,71.12
IGNVCC  (via drill 0.6)
  Top 0.61: IC1.6 31.75,65.41 32.38,64.77 34.29,64.77 34.92,65.41 C26.2 v34.92,67.94 | IC2.6 41.91,65.41 41.27,64.77 38.1,64.77 37.47,65.41 C25.2 | 37.47,67.31 C25.2 | v37.47,67.94 C25.2
  Bottom 0.813: JP2.2 33.02,66.04 v34.92,67.94 v37.47,67.94
N$1
  Top 0.61: C2.1 61.59,31.75 | 61.59,31.75 60.96,31.75 59.69,33.02 54.61,33.02 53.34,34.29 PAD5.1 | R2.1 60.33,28.09 R1.1 61.44,31.6 61.59,31.75
N$2
  Top 0.61: PAD27.1 48.26,34.92 43.81,30.48 43.81,27.3 45.09,26.04 45.09,22.23 45.94,21.38 C14.1 47.56,20.8 R11.1
N$3
  Top 0.406: 50.65,23.65 51.44,22.86 D2.3
  Top 0.61: D2.3 55.29,22.01 C13.1 56.52,20.95 57.15,20.32 AD1.1 | R11.2 50.65,23.65
N$4
  Top 0.406: 50.65,30 51.44,29.21 D4.3
  Top 0.61: D4.3 55.29,28.36 C15.1 56.52,27.3 58.42,25.4 58.42,10.79 57.15,9.53 AD2.1 | R13.2 50.65,30
N$5
  Top 0.61: PAD28.1 48.26,40.01 49.53,38.73 49.53,34.29 45.09,29.84 45.09,28.57 45.94,27.73 C16.1 47.56,27.15 R13.1
N$6
  Top 0.406: D1.3 64.14,29.06
  Top 0.61: D1.3 63.28,23.45 C1.1 60.96,21.59 59.69,20.32 ADB1.1 | 64.14,29.06 R1.2
N$7
  Top 2.184: Q6.3 49.53,72.62 X1.6
N$8
  Top 0.406: D3.3 72.39,29.06
  Top 0.61: D3.3 71.54,23.45 C3.1 69.85,21.59 67.94,19.68 64.14,19.68 60.96,16.51 60.96,10.79 59.69,9.53 ADB2.1 | 72.39,29.06 R3.2
N$9
  Top 0.61: C4.1 69.85,31.75 | 69.85,31.75 67.94,31.75 65.41,34.29 55.24,34.29 54.61,34.92 54.61,38.73 53.34,40.01 PAD6.1 | R7.1 68.58,28.09 R3.1 69.7,31.6 69.85,31.75
N$10
  Top 0.61: PAD29.1 43.18,40.01 41.91,38.73 41.91,34.92 41.27,34.29 31.11,34.29 27.94,31.11 27.94,23.5 30.06,21.38 C18.1 32.32,20.8 R14.1
N$11
  Top 0.406: 34.77,23.65 35.56,22.86 D6.3
  Top 0.61: D6.3 39.41,22.01 C17.1 40.64,20.95 45.09,16.51 50.16,16.51 50.8,15.88 50.8,10.79 52.07,9.53 AD3.1 | R14.2 34.77,23.65
N$12
  Top 0.61: R33.1 29.84,54.92 | 29.84,54.92 29.84,53.98 30.48,53.34 35.56,53.34 38.73,50.16 41.27,50.16 45.72,45.72 52.7,45.72 53.98,44.45 61.59,44.45 66.04,40.01 IGN1.1 | 29.84,54.92 R37.2
N$13
  Top 0.406: 34.77,30 35.56,29.21 D8.3
  Top 0.61: D8.3 39.41,28.36 C19.1 40.64,26.67 42.55,24.77 42.55,20.95 45.72,17.78 50.8,17.78 52.07,16.51 AD4.1 | R15.2 34.77,30
N$14
  Top 0.61: IGN2.1 69.22,41.27 67.94,42.55 65.41,42.55 62.23,45.72 54.61,45.72 53.34,46.99 46.35,46.99 41.91,51.44 39.37,51.44 35.56,55.24 R38.2 35.24,56.2 34.29,57.15 33.98,57.15 R34.1
N$15
  Top 0.61: PAD30.1 43.18,33.66 42.55,33.02 31.75,33.02 29.21,30.48 29.21,27.94 29.43,27.73 C20.1 32.32,27.15 R15.1
N$18
  Top 0.406: D5.3 80.64,29.06
  Top 0.61: D5.3 79.8,23.45 C5.1 76.2,21.59 73.03,18.41 64.77,18.41 62.23,15.88 ADB3.1 | 80.64,29.06 R4.2
N$19
  Top 0.406: D7.3 88.9,29.06
  Top 0.61: D7.3 88.05,23.45 C7.1 84.45,21.59 82.55,19.68 76.2,19.68 73.66,17.14 65.41,17.14 63.5,15.24 63.5,10.79 62.23,9.53 ADB4.1 | 88.9,29.06 R5.2
N$23
  Top 0.61: C6.1 78.11,31.75 | 78.11,31.75 76.2,31.75 74.3,33.66 67.94,33.66 64.77,36.83 PAD7.1 | R12.1 76.83,28.09 R4.1 77.95,31.6 78.11,31.75
N$24
  Top 0.61: R47.2 69.85,8.26 66.04,4.45 55.24,4.45 54.61,5.08 PA6.1
N$25
  Top 0.61: 38.1,55.24 38.1,54.93 R40.1 | IGN3.1 64.77,45.09 62.87,46.99 55.24,46.99 53.98,48.26 46.99,48.26 42.55,52.7 40.01,52.7 38.73,53.98 38.73,54.93 R40.1 | R40.1 38.42,56.2 39.37,57.15 39.69,57.15 R35.1
N$26
  Top 0.61: R36.1 43.81,54.92 R39.1 44.45,54.29 44.45,52.7 47.62,49.53 54.61,49.53 55.88,48.26 63.5,48.26 64.77,46.99 68.58,46.99 69.22,46.35 IGN4.1
N$27
  Top 1.016: IC1.7 30.48,68.58 26.67,72.39 R52.1
N$28
  Top 1.016: IC2.5 43.18,69.22 40.64,71.75 R55.1
N$29
  Top 0.61: C8.1 86.36,31.75 | 86.36,31.75 84.45,31.75 82.55,33.66 76.2,33.66 74.93,34.92 68.58,34.92 61.59,41.91 PAD8.1 | R17.1 85.09,28.09 R5.1 86.21,31.6 86.36,31.75
N$30
  Bottom 0.813: JP6.1 R6.2 20.32,2.54 VR1-.MP
N$31
  Top 1.016: IC1.5 33.02,69.22 R53.1
N$32
  Top 1.016: IC2.7 40.64,68.58 38.1,71.12 R54.1
N$33
  Top 0.61: R9.1 32.38,2.54 31.75,3.17 JP6.2
  Bottom 0.813: JP6.2 31.75,6.35 30.48,7.62 22.86,7.62 20.32,5.08 R6.1 6.35,5.08 VR1+.MP
N$34
  Top 0.61: R10.1 32.38,15.24 31.75,14.61 JP7.2
  Bottom 0.813: JP7.2 31.75,11.43 30.48,10.16 22.86,10.16 20.32,12.7 R8.2 6.35,12.7 VR2+.MP
N$35
  Bottom 0.813: JP7.1 R8.1 20.32,15.24 VR2-.MP
N$36
  Top 0.406: D15.3 85.09,45.09 86.36,46.35
  Top 0.61: D15.3 84.24,41.23 C24.1 84.24,35.77 86.36,33.66 90.81,33.66 92.71,31.75 92.71,20.95 91.44,19.68 84.45,19.68 83.19,18.41 76.83,18.41 74.3,15.88 66.04,15.88 64.77,14.61 ACCMON.1 | 86.36,46.35 86.36,46.67 R50.2
N$37
  Top 0.406: D16.3 90.17,45.09 88.9,46.35
  Top 0.61: D16.3 89.32,41.23 C23.1 89.32,35.77 90.17,34.92 91.44,34.92 93.98,32.38 93.98,20.32 92.08,18.41 85.09,18.41 83.82,17.14 77.47,17.14 74.93,14.61 66.67,14.61 66.04,13.97 66.04,10.79 64.77,9.53 INJMON.1 | 88.9,46.35 88.9,46.67 R51.2
N$38
  Top 0.61: R30.2 55.88,52.7 | 55.88,52.7 R29.1 | 55.88,52.7 55.88,52.07 57.15,50.8 64.77,50.8 66.04,49.53 71.12,49.53 71.75,48.9 ACC1.1
N$39
  Top 2.184: Q5.3 58.42,72.13 X1.8
N$40
  Top 0.61: INJ1.1 74.3,41.91 73.03,43.18 73.03,49.53 71.75,50.8 66.04,50.8 64.77,52.07 64.77,52.7 | R22.2 64.77,52.7 | 64.77,52.7 R21.1
N$41
  Top 0.61: INJ2.1 74.3,50.16 73.66,50.8 73.66,52.7 | R24.2 73.66,52.7 | 73.66,52.7 R23.1
N$42
  Top 0.61: INJ3.1 76.83,41.91 75.56,43.18 75.56,49.53 76.83,50.8 81.28,50.8 82.55,52.07 82.55,52.7 | R26.2 82.55,52.7 | 82.55,52.7 R25.1
N$43
  Top 0.61: INJ4.1 76.83,47.62 77.47,48.26 80.01,48.26 81.28,49.53 82.55,49.53 83.82,50.8 90.17,50.8 91.44,52.07 91.44,52.7 | R28.2 91.44,52.7 | 91.44,52.7 R27.1
N$44
  Top 0.61: IC1.2 30.48,60.96 29.84,60.33 R33.2
N$45
  Top 0.61: IC1.4 33.02,60.96 33.66,60.33 R34.2
N$46
  Top 0.61: IC2.4 43.18,60.96 43.81,60.33 R36.2
N$47
  Top 0.61: IC2.2 40.64,60.96 40.01,60.33 R35.2
N$48
  Top 0.61: R45.2 22.86,74.93 21.59,76.2 18.62,76.2 X2.2
N$49
  Bottom 0.813: JP6.3 34.29,3.81 35.56,2.54 41.91,2.54 43.18,3.81 JP1.1
N$50
  Bottom 1.27: X1.1 44.24,78.95 41.91,81.28 29.21,81.28 R52.2
N$51
  Bottom 1.27: R43.1 13.97,64.77 13.97,71.55 X2.5
N$52
  Bottom 1.27: R42.1 11.43,73.2 X2.4
N$53
  Top 0.61: R31.1 46.99,52.7 | 46.99,52.7 46.99,52.07 48.26,50.8 55.24,50.8 56.52,49.53 64.14,49.53 65.41,48.26 69.85,48.26 70.48,47.62 70.48,43.18 71.75,41.91 ACC2.1 | R32.2 46.99,52.7
N$54
  Bottom 1.27: X1.2 48.7,78.55 46.35,76.2 40.01,76.2 37.47,78.74 33.66,78.74 R53.2
N$55
  Top 1.27: R54.2 50.15,76.2 X1.3
N$56
  Bottom 0.813: JP6.4 36.83,6.35 38.1,7.62 39.37,7.62 44.45,7.62 45.72,6.35 JP1.2
N$57
  Top 0.406: D11.3 31.75,43.18
  Top 0.61: 31.75,43.18 30.48,44.45 30.48,45.55 D13.3 30.65,48.11 R19.2 | R16.1 33.02,36.83 33.02,39.37 31.75,39.37 D11.3
N$58
  Top 0.61: R20.1 26.82,50.32 27.3,50.8 34.29,50.8 38.1,46.99 PAD36.1
N$60
  Top 0.406: D12.3 25.4,43.18
  Top 0.61: 25.4,43.18 24.13,44.45 24.13,45.55 D14.3 24.3,48.11 R20.2 | D12.3 R18.1
N$61
  Top 0.61: 73.98,59.97 Q2.1 73.92,57.73 R23.2
N$62
  Top 0.61: 82.87,59.97 Q3.1 82.81,57.73 R25.2
N$63
  Top 0.61: Q4.1 91.7,57.73 R27.2
N$64
  Top 0.61: Q5.1 56.14,57.73 R29.2
N$65
  Top 0.61: 47.31,59.97 Q6.1 47.25,57.84 R31.2
N$66
  Top 0.61: 65.09,59.97 Q1.1 65.03,57.73 R21.2
N$67
  Top 0.406: R44.2 25.4,60.33 D10.3
  Top 0.61: D10.3 C21.1 25.18,53.55 26.67,52.07 34.92,52.07 38.1,48.9 40.64,48.9 44.45,45.09 44.45,33.02 42.55,31.11 42.55,26.67 43.81,25.4 43.81,21.59 46.35,19.05 51.44,19.05 54.61,15.88 BRV.1
N$68
  Top 0.61: R45.1 22.86,67.94 22.23,67.31 22.23,66.99 R46.2 22.01,66.67 C22.1 21.59,63.72 21.59,61.59 R44.1
N$69
  Top 1.27: R55.2 40.64,79.38 42.55,81.28 54.77,81.28 X1.4
N$70
  Top 0.61: R57.1 HALL2.1
N$71
  Top 0.61: R16.2 28.57,36.83 28.57,33.66 26.67,31.75 26.67,22.86 30.48,19.05 40.64,19.05 44.45,15.24 48.9,15.24 49.53,14.61 SW1.1
N$72
  Top 0.61: R19.1 34.29,48.9 35.56,47.62 35.56,41.27 38.1,38.73 PAD35.1
N$73
  Top 0.61: R18.2 25.4,22.23 29.84,17.78 40.01,17.78 43.81,13.97 47.62,13.97 48.26,13.34 48.26,10.79 49.53,9.53 SW2.1
N$74
  Top 0.61: R56.1 HALL1.1
N$80
  Top 2.184: Q4.3 93.98,74.26 X3.3
N$81
  Top 0.61: R48.2 86.67,11.12 LD_RUN1.1 86.67,10.47 86.67,9.21 85.72,8.26 | R49.2 95.25,8.89 94.61,8.26 85.72,8.26 | 85.72,8.26 R47.1
N$82
  Top 2.184: Q3.3 X3.5
N$83
  Top 2.184: X3.2 85.09,78.74 82.55,76.2 78.74,76.2 76.2,73.66 Q2.3
N$84
  Top 2.184: X3.1 73.87,78.95 67.31,72.39 Q1.3
N$86
  Top 0.61: R48.1 86.67,13.02 CEL-.1

### Text on the board
tPlace: ACC1 | ACC2 | INJ1 | INJ2 | INJ3 | INJ4 | Switch 1-2 | 1 | 1 | CPU Driver Connector | GND Monitor | Sensor Connector / GND | A/D Bias 5-8 | A/D 1-4 | - CEL + | 1 | + VR2 - | Load/Run | 1 | ONIONBOARD | CPU Input Connector | GIT %GIT_COMMIT_ID% | - VR1 + | VR1 | VR2 | BrickRPM
bPlace: IGN3-4 | IGN1-2 | 12V | BRV | GND | INJ1 | INJ2 | INJ4 | VREF | VREF | GND | GND | ACC1 | ACCGND | ACC2 | INJGND | INJ3 | INJGND | 12V | 5V